# Altium schematic sheet TI_DSP_OLD.SchDoc
size A
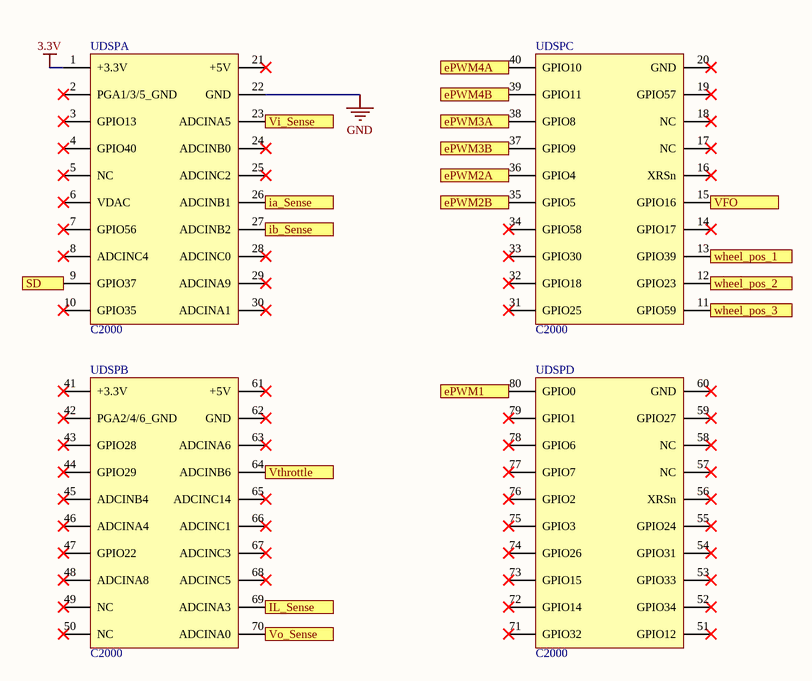
[diagram p0: TI_DSP_OLD.SchDoc]

## Parts
UDSP  C2000  [C2000]  (parts A,B,C,D of 4)

## Ports
ePWM1 (out), ePWM2A (out), ePWM2B (out), ePWM3A (out), ePWM3B (out), ePWM4A (out), ePWM4B (out), ia_Sense (in), ib_Sense (in), IL_Sense (in), SD (out), VFO (in), Vi_Sense (in), Vo_Sense (in), Vthrottle (in), wheel_pos_1 (in), wheel_pos_2 (in), wheel_pos_3 (in)

## Nets
3.3V: UDSP.1(+3.3V)
GND: UDSP.22(GND)
ePWM1: UDSP.80(GPIO0) ; port ePWM1
ePWM2A: UDSP.36(GPIO4) ; port ePWM2A
ePWM2B: UDSP.35(GPIO5) ; port ePWM2B
ePWM3A: UDSP.38(GPIO8) ; port ePWM3A
ePWM3B: UDSP.37(GPIO9) ; port ePWM3B
ePWM4A: UDSP.40(GPIO10) ; port ePWM4A
ePWM4B: UDSP.39(GPIO11) ; port ePWM4B
ia_Sense: UDSP.26(ADCINB1) ; port ia_Sense
ib_Sense: UDSP.27(ADCINB2) ; port ib_Sense
IL_Sense: UDSP.69(ADCINA3) ; port IL_Sense
SD: UDSP.9(GPIO37) ; port SD
VFO: UDSP.15(GPIO16) ; port VFO
Vi_Sense: UDSP.23(ADCINA5) ; port Vi_Sense
Vo_Sense: UDSP.70(ADCINA0) ; port Vo_Sense
Vthrottle: UDSP.64(ADCINB6) ; port Vthrottle
wheel_pos_1: UDSP.13(GPIO39) ; port wheel_pos_1
wheel_pos_2: UDSP.12(GPIO23) ; port wheel_pos_2
wheel_pos_3: UDSP.11(GPIO59) ; port wheel_pos_3

Not connected (* = marked no-connect by the designer): UDSP 2(PGA1/3/5_GND)* 3(GPIO13)* 4(GPIO40)* 5(NC)* 6(VDAC)* 7(GPIO56)* 8(ADCINC4)* 10(GPIO35)* 14(GPIO17)* 16(XRSn)* 17(NC)* 18(NC)* 19(GPIO57)* 20(GND)* 21(+5V)* 24(ADCINB0)* 25(ADCINC2)* 28(ADCINC0)* 29(ADCINA9)* 30(ADCINA1)* 31(GPIO25)* 32(GPIO18)* 33(GPIO30)* 34(GPIO58)* 41(+3.3V)* 42(PGA2/4/6_GND)* 43(GPIO28)* 44(GPIO29)* 45(ADCINB4)* 46(ADCINA4)* 47(GPIO22)* 48(ADCINA8)* 49(NC)* 50(NC)* 51(GPIO12)* 52(GPIO34)* 53(GPIO33)* 54(GPIO31)* 55(GPIO24)* 56(XRSn)* 57(NC)* 58(NC)* 59(GPIO27)* 60(GND)* 61(+5V)* 62(GND)* 63(ADCINA6)* 65(ADCINC14)* 66(ADCINC1)* 67(ADCINC3)* 68(ADCINC5)* 71(GPIO32)* 72(GPIO14)* 73(GPIO15)* 74(GPIO26)* 75(GPIO3)* 76(GPIO2)* 77(GPIO7)* 78(GPIO6)* 79(GPIO1)*

## Library data of the parts
UDSP = C2000: F280049C; Parameter 1: test 2